# Altium project S bus (5.775 X 3.30 inches).PrjPCB
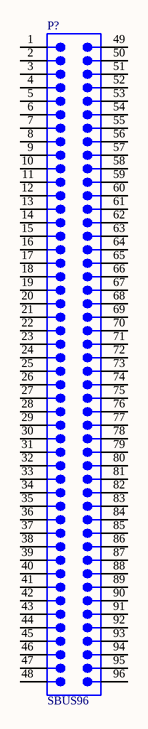
[diagram p0: S bus (5.775 X 3.30 inches).schdoc]
1 sheet, 1 parts. Net scope: global (net labels, ports and power ports of the same name join across sheets).
Board file: S bus (5.775 X 3.30 inches).PCBDOC

## Sheet S bus (5.775 X 3.30 inches).schdoc: S bus (5.775 X 3.30 inches)
size A; Organization: Organization; Address1: Address1; Address2: Address2; Address3: Address3; Address4: Address4; DocumentNumber: 1; Revision: 0; SheetNumber: 2; SheetTotal: 2

### Parts
P?  SBUS96  [SBUS96]

### Nets

Not connected (* = marked no-connect by the designer): P? 1 2 3 4 5 6 7 8 9 10 11 12 13 14 15 16 17 18 19 20 21 22 23 24 25 26 27 28 29 30 31 32 33 34 35 36 37 38 39 40 41 42 43 44 45 46 47 48 49 50 51 52 53 54 55 56 57 58 59 60 61 62 63 64 65 66 67 68 69 70 71 72 73 74 75 76 77 78 79 80 81 82 83 84 85 86 87 88 89 90 91 92 93 94 95 96

### Library data of the parts
P? = SBUS96: 96-Pin Connector; Text Field6: Alternate Layout Available; Text Field7: Published 14-Feb-2002